# Altium schematic sheet cSLIM_power.SchDoc
size 297 x 210 mm; SheetNumber: 7
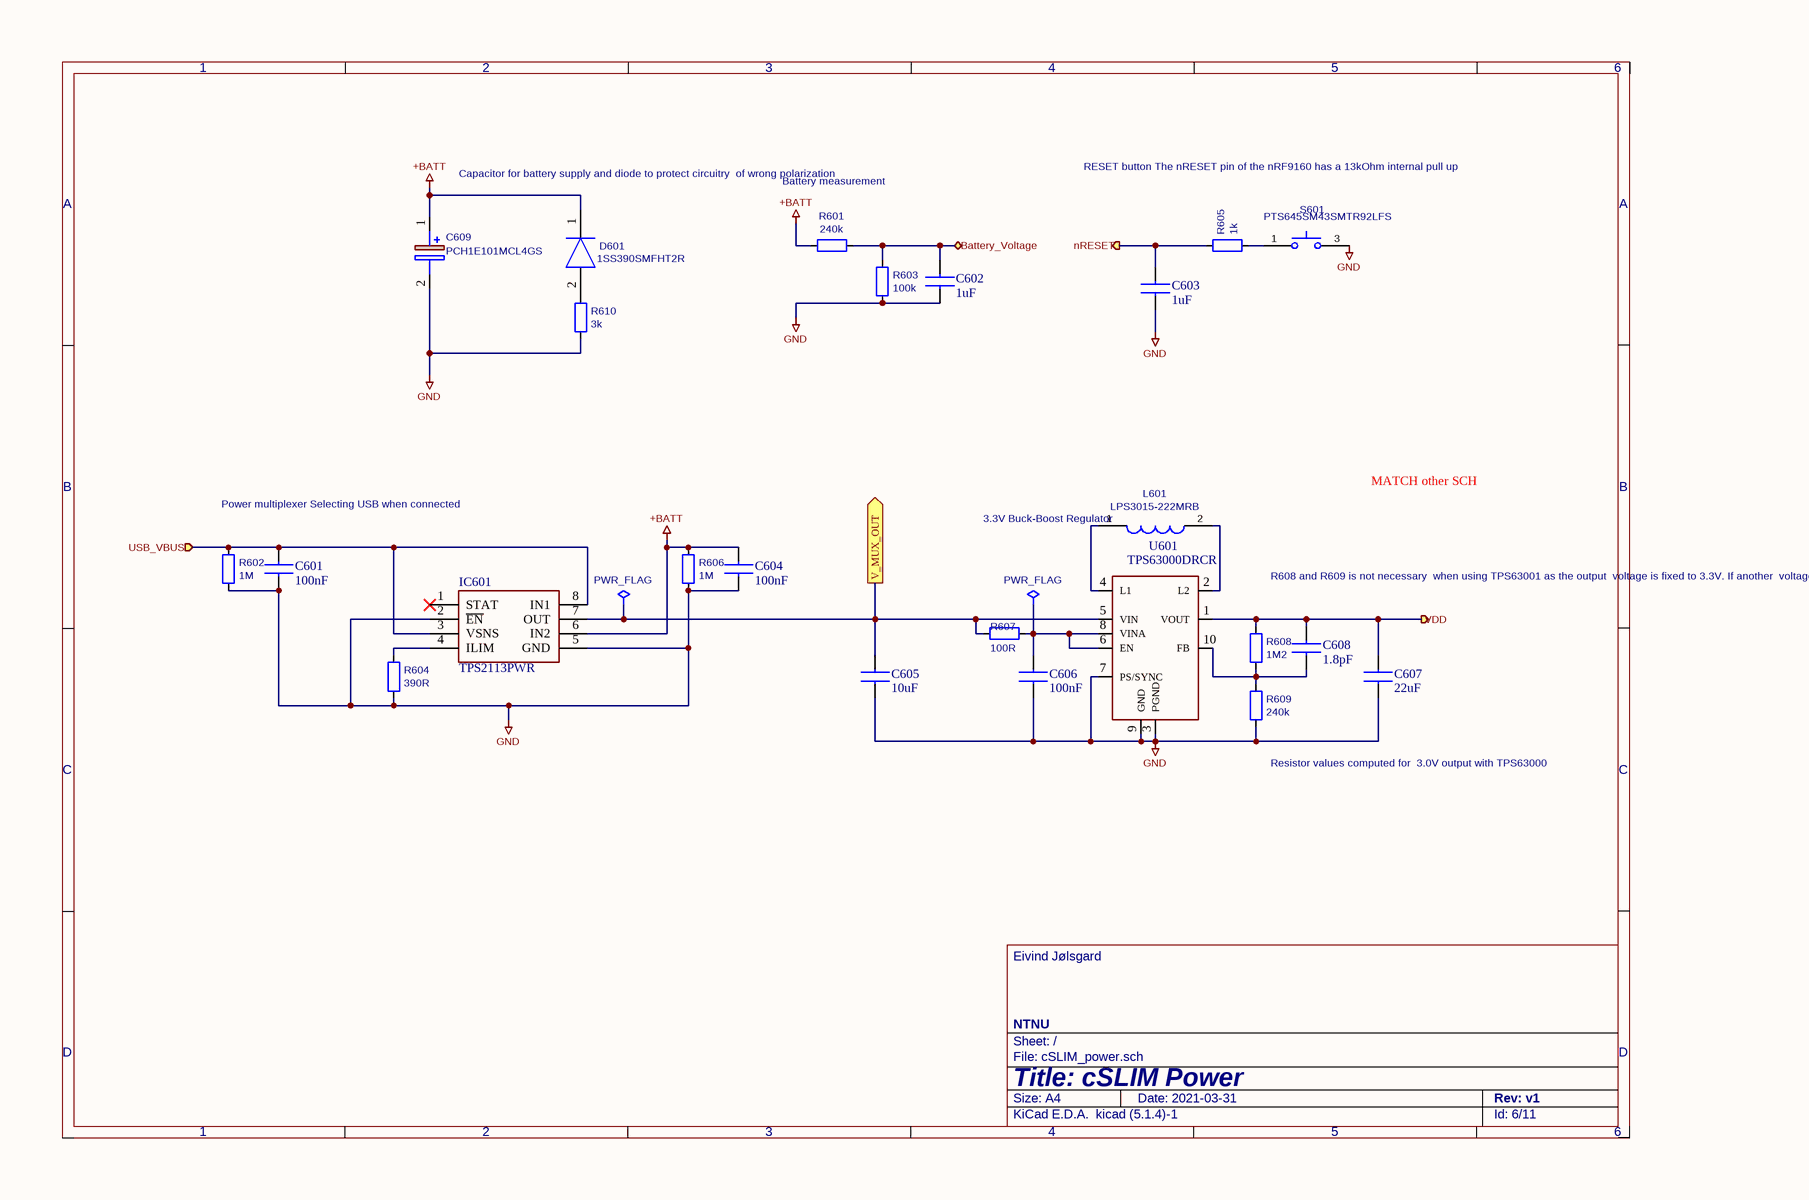
[diagram p0: cSLIM_power.SchDoc]

## Parts
#FLG0103  PWR_FLAG  (graphical)
#FLG0105  PWR_FLAG  (graphical)
C601  100nF  [CAPC1608X90N]
C602  1uF  [CAPC1608X90N]
C603  1uF  [CAPC1608X90N]
C604  100nF  [CAPC1608X90N]
C605  10uF  [CAPC1608X90N]
C606  100nF  [CAPC1608X90N]
C607  22uF  [CAPC1608X90N]
C608  1.8pF  [CAPC1608X90N]
C609  PCH1E101MCL4GS  [CAPAE660X840N]
D601  1SS390SMFHT2R  [SODFL1608X70N]
IC601  TPS2113PWR  [SOP65P640X120-8N]
L601  LPS3015-222MRB  [LPS3015]
R601  240k  [RESC1608X55N]
R602  1M  [RESC1608X55N]
R603  100k  [RESC1608X55N]
R604  390R  [RESC1608X55N]
R605  1k  [RESC1608X55N]
R606  1M  [RESC1608X55N]
R607  100R  [RESC1608X55N]
R608  1M2  [RESC1608X55N]
R609  240k  [RESC1608X55N]
R610  3k  [RESC1608X55N]
S601  value PTS645SM43SMTR92LFS  [PTS645(SMT)]
U601  TPS63000DRCR  [TPS63002DRCR]

## Ports
Battery_Voltage (bidir), nRESET (out), USB_VBUS (in), V_MUX_OUT (out), VDD (out)

## Nets
+BATT: C604.1 C609.1(+) D601.1(K) IC601.6(IN2) R601.2 R606.1
GND: C601.2 C602.2 C603.2 C604.2 C605.2 C606.2 C607.2 C609.2(-) IC601.2(~{EN}) IC601.5(GND) R602.2 R603.2 R604.2 R606.2 R609.2 R610.2 S601.3 U601.3(PGND) U601.7(PS/SYNC) U601.9(GND)
Battery_Voltage: C602.1 R601.1 R603.1 ; port Battery_Voltage
nRESET: C603.1 R605.1 ; port nRESET
USB_VBUS: C601.1 IC601.3(VSNS) IC601.8(IN1) R602.1 ; port USB_VBUS
V_MUX_OUT: #FLG0103.1(pwr) C605.1 IC601.7(OUT) R607.2 U601.5(VIN) ; port V_MUX_OUT
VDD: C607.1 C608.1 R608.1 U601.1(VOUT) ; port VDD
Net#FLG0105_1: #FLG0105.1(pwr) C606.1 R607.1 U601.6(EN) U601.8(VINA)
NetC608_2: C608.2 R608.2 R609.1 U601.10(FB)
NetD601_2: D601.2(A) R610.1
NetIC601_4: IC601.4(ILIM) R604.1
NetL601_1: L601.1 U601.4(L1)
NetL601_2: L601.2 U601.2(L2)
NetR605_2: R605.2 S601.1

Not connected (* = marked no-connect by the designer): IC601 1(STAT)*

## Notes on the sheet
- Capacitor for battery supply
  and diode to protect circuitry
  of wrong polarization
- Battery measurement
- RESET button
  The nRESET pin of the nRF9160 has a 13kOhm internal pull up
- Power multiplexer
  Selecting USB when connected
- MATCH other SCH
- (near L601) 3.3V Buck-Boost Regulator
- R608 and R609 is not necessary
  when using TPS63001 as the output
  voltage is fixed to 3.3V. If another
  voltage is required use TPS63000
  with appropriate resistor values
- (near R609) Resistor values computed for
  3.0V output with TPS63000
- 1
- 2
- 3
- 4
- 5
- 6
- A
- B
- C
- Eivind Jølsgard
- D
- Title: cSLIM Power
- File: cSLIM_power.sch
- Sheet: /
- NTNU
- KiCad E.D.A.  kicad (5.1.4)-1
- Size: A4
- Date: 2021-03-31
- Rev: v1
- Id: 6/11

## Library data of the parts
C601-C608 = C: Capacitor; Manufacturer_Name: AVX; Manufacturer_Part_Number: 06033G104ZAT2A; Datasheet Link: http://www.mouser.com/catalog/supplier/library/pdf/AVXSurfaceMountCeramic.pdf; Height: 0.9mm; Mouser Part Number: 581-06033G104Z; Mouser Price/Stock: https://www.mouser.co.uk/ProductDetail/AVX/06033G104ZAT2A?qs=NXubJDmysXJMPmHfVo6Z%252BA%3D%3D; Arrow Part Number: 06033G104ZAT2A; Arrow Price/Stock: https://www.arrow.com/en/products/06033g104zat2a/avx?region=nac
C609 = PCH1E101MCL4GS: Capacitor Polarised; Manufacturer_Name: Nichicon; Datasheet Link: https://componentsearchengine.com/Datasheets/2/PCH1E101MCL4GS.pdf; Height: 8.4mm; Manufacturer_Part_Number: PCH1E101MCL4GS; Mouser Part Number: 647-PCH1E101MCL4GS; Mouser Price/Stock: https://www.mouser.co.uk/ProductDetail/Nichicon/PCH1E101MCL4GS?qs=vmHwEFxEFR%252Bar6ugXaASOA%3D%3D
D601 = 1SS390SMFHT2R: Diode; Manufacturer_Name: ROHM Semiconductor; Height: 0.7mm; Mouser Part Number: 755-1SS390SMFHT2R; Mouser Price/Stock: https://www.mouser.co.uk/ProductDetail/ROHM-Semiconductor/1SS390SMFHT2R?qs=0lSvoLzn4L%2FO2HkvK5CJsQ%3D%3D; Manufacturer_Part_Number: 1SS390SMFHT2R; Datasheet Link: https://componentsearchengine.com/Datasheets/2/1SS390SMFHT2R.pdf
IC601 = TPS2113PWR: Integrated Circuit; Manufacturer_Name: Texas Instruments; Datasheet Link: http://www.ti.com/lit/ds/symlink/tps2113.pdf; Height: 1.2mm; Manufacturer_Part_Number: TPS2113PWR; Mouser Part Number: 595-TPS2113PWR; Mouser Price/Stock: https://www.mouser.co.uk/ProductDetail/Texas-Instruments/TPS2113PWR?qs=ojKcPFmCWSUJzuMPtPVtlA%3D%3D; Arrow Part Number: TPS2113PWR; Arrow Price/Stock: https://www.arrow.com/en/products/tps2113pwr/texas-instruments
L601 = LPS3015-103MRB: Manufacturer_Name: COILCRAFT; Mouser Part Number: 994-LPS3015-103MRB; Mouser Price/Stock: https://www.mouser.co.uk/ProductDetail/Coilcraft/LPS3015-103MRB?qs=QQJxVsr8EGaKHQsQv461ew%3D%3D; Manufacturer_Part_Number: LPS3015-103MRB; Value: LPS3015-222MRB; Footprint: SamacSys:LPS3015
R601-R610 = R
  R601 R609: Value: 240k
  R602 R606: Value: 1M
  R603: Value: 100k
  R604: Value: 390R
  R605: Value: 1k
  R607: Value: 100R
  R608: Value: 1M2
  R610: Value: 3k
S601 = PTS645SM43SMTR92LFS: Switch 4-pi. used 1-3 (2-4 not in use); Manufacturer_Name: C & K COMPONENTS; Manufacturer_Part_Number: TLS A 070J LFS; Description_: Tactile Switches Top actuated tact, 0.9 mm travel, 7 N, 50% Tactile, J Leads, SMT, 8.6 x 8.4 x 3.95 mm, Soft Actuator; Footprint: TLSA070JLFS; Supplier: https://www.mouser.ph/datasheet/2/60/tls-1846606.pdf; Mouser Part Number: 611-TLSA070JLFS; Mouser Price/Stock: https://www.mouser.co.uk/ProductDetail/CK/TLS-A-070J-LFS?qs=GedFDFLaBXEdAqJ422mDcw%3D%3D
U601 = TPS63000DRCR: Integrated Circuit; Manufacturer_Name: Texas Instruments; Datasheet Link: https://www.ti.com/lit/ds/symlink/tps63000.pdf?HQS=ti-null-null-sf-df-pf-sep-wwe&ts=1593405994673; Height: 1mm; Manufacturer_Part_Number: TPS63000DRCR; Mouser Part Number: 595-TPS63000DRCR; Mouser Price/Stock: https://www.mouser.co.uk/ProductDetail/Texas-Instruments/TPS63000DRCR?qs=QZuYiDxzHaj%2FxB6t44u%252B6Q%3D%3D; Arrow Part Number: TPS63000DRCR; Arrow Price/Stock: https://www.arrow.com/en/products/tps63000drcr/texas-instruments?region=nac
#FLG0103 #FLG0105 = PWR_FLAG: Value: PWR_FLAG